# EAGLE board DUE_V02g (EAGLE 9.6.2), part 1 of 2
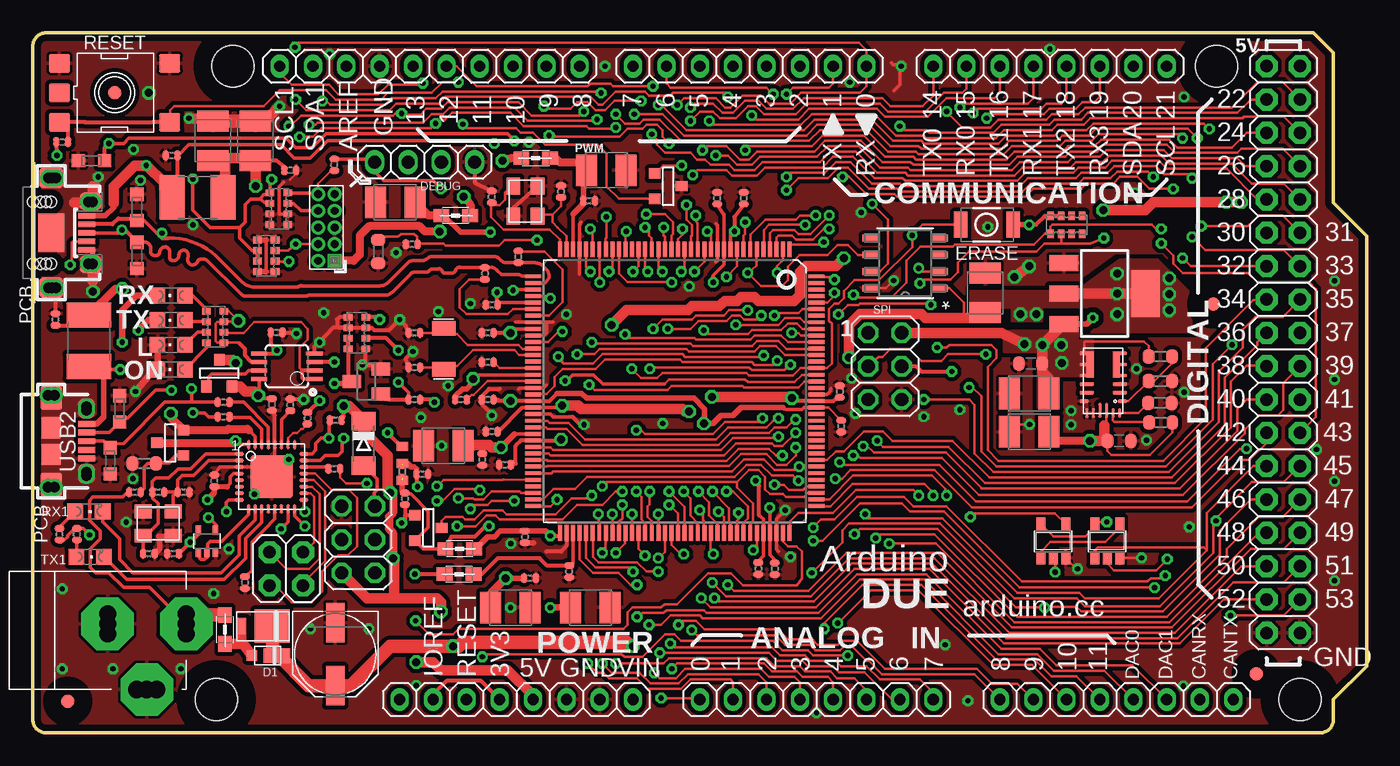
[diagram p2: board, top side]
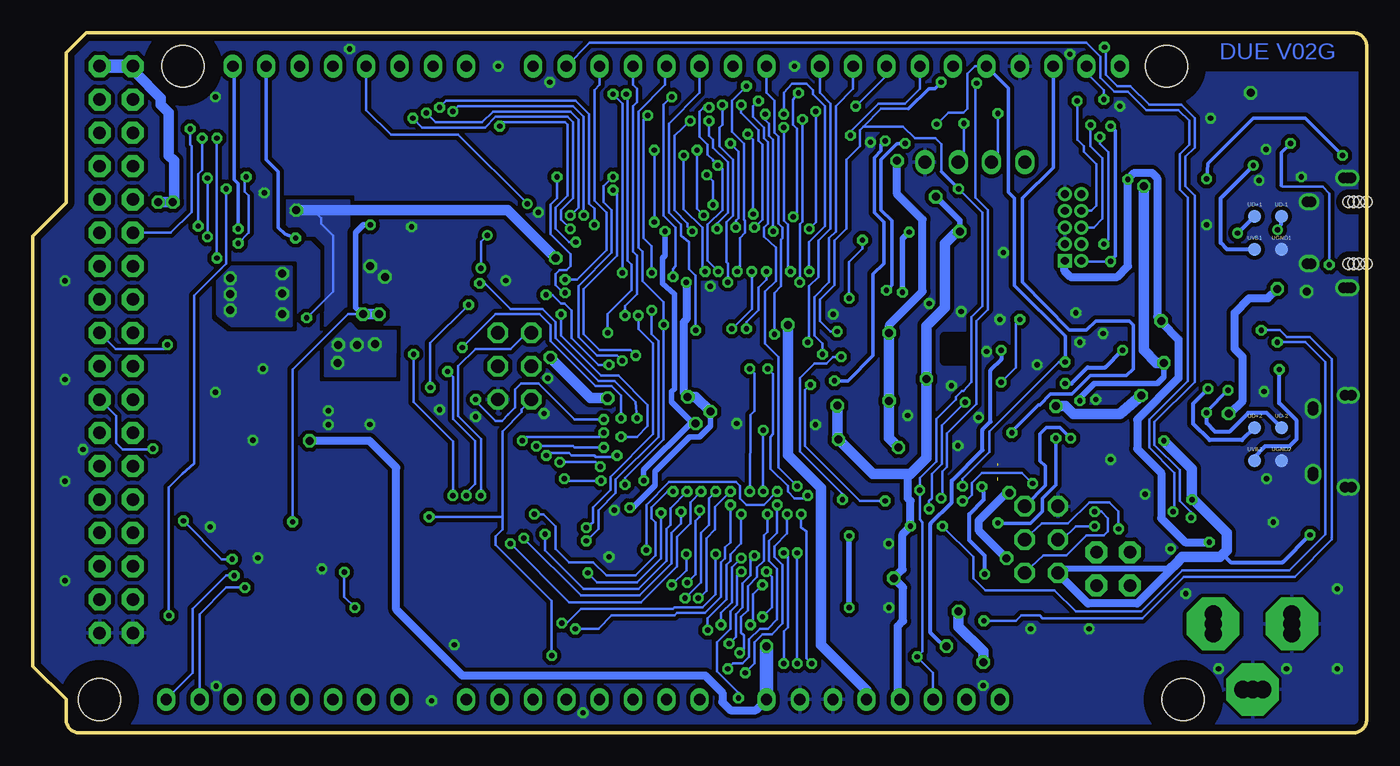
[diagram p3: board, bottom side, seen from below]

Size 101.6 x 53.34 mm. Coordinates in mm from the lower left corner, seen from the top.
Outline: 97.54,53.34 99.06,51.82 99.06,40.39 101.6,37.85 101.6,5.08 99.06,2.54 99.06,1 arc-90 98.06,0 1,0 arc-90 0,1 0,52.34 arc-90 1,53.34 97.54,53.34
Copper layers (1*16): Top 0.035mm / dielectric 1.6mm / Bottom 0.035mm
Design rules "default *": minimum track width 8mil, minimum drill 16mil, track to track 8mil, track to pad 8mil, pad to pad 8mil, via to via 8mil, smd to smd 6mil, copper to edge 20mil, drill to drill 12mil, minimum pad ring 9mil, minimum via ring 8mil, stop-mask expansion 2mil, vias tented up to drill 25mil, thermal gap 8mil
Net classes: 0 default: width 0.203 mm, drill 0.406 mm, clearance 0.203 mm; 1 USB: width 0.203 mm, drill 0.406 mm, clearance 0.203 mm; 2 gnd: width 0.203 mm, drill 0.406 mm, clearance 0.203 mm; 3 usbvcc: width 0.203 mm, drill 0.406 mm, clearance 0.203 mm; 4 USBpair: width 0.254 mm, drill 0.406 mm, clearance 0.61 mm to class 0, clearance 0.61 mm to class 1, clearance 0.61 mm to class 2, clearance 0.61 mm to class 3
Holes 3.2 mm at 96.52,2.54 15.24,50.8 90.17,50.8 13.97,2.54
tRestrict: area 12.7,48.3 to 17.8,53.3; area 87.6,48.3 to 92.7,53.3; area 94,0 to 99.1,5.1; area 11.4,0 to 16.5,5.1
bRestrict: area 12.7,48.3 to 17.8,53.3; area 87.6,48.3 to 92.7,53.3; area 94,0 to 99.1,5.1; area 11.4,0 to 16.5,5.1; 1 lines

## Footprints (pad centres in the part's own frame; a part is rotated, then mirrored left to right if it is on the bottom)
1X08 = drill 0.85 pad 1.422 long: 1 -8.89,0; 2 -6.35,0; 3 -3.81,0; 4 -1.27,0; 5 1.27,0; 6 3.81,0; 7 6.35,0; 8 8.89,0
J0402 = smd 0.7 x 0.9: 1 -0.65,0; 2 0.65,0; 3 1.95,0
SMC_B = smd 1.6 x 2.4: + -1.5,0; - 1.5,0
C0402 = smd 0.508 x 0.762: 1 -0.445,0; 2 0.445,0
C0603-ROUND = smd 0.898 x 1.1: 1 -0.889,0; 2 0.889,0
PINHEAD_2X05_127 = drill 0.6 pad 1.016 square: 1 -0.635,2.54 | drill 0.6 pad 1.016: 2 0.635,2.54; 3 -0.635,1.27; 4 0.635,1.27; 5 -0.635,0; 6 0.635,0; 7 -0.635,-1.27; 8 0.635,-1.27; 9 -0.635,-2.54; 10 0.635,-2.54
MICROSMP = smd 0.8 x 0.8: A 1.2,0 | smd 2 x 1.1: K -0.7,0
MINIMELF = smd 1.4 x 1.8: A 1.7,0; C -1.7,0
DO220AAL = smd 2.667 x 2.54: P$1 -0.7,0 | smd 0.762 x 1.27: P$2 1.65,0
PH1X4-THT = drill 1 pad 1.422 long: 1 0,0; 2 2.54,0; 3 5.08,0; 4 7.62,0
SMD_157SW = smd 1.016 x 1.981: 1 0,0; 2 4,0
L1812 = smd 1.9 x 3.4: 1 -1.95,0; 2 1.95,0
FIDUCIA-MOUNT = smd 1.016 x 1.016: P$1 0,0
MSOP08 = smd 0.3 x 1.2: 1 -0.976,-2.113; 2 -0.326,-2.113; 3 0.324,-2.113; 4 0.974,-2.113; 5 0.974,2.112; 6 0.324,2.112; 7 -0.326,2.112; 8 -0.976,2.112
SOT23-5 = smd 0.69 x 0.99: 1 -0.95,-1.29; 2 0,-1.29; 3 0.95,-1.29; 4 0.95,1.3; 5 -0.95,1.3
SOT223 = smd 1.219 x 2.235: 1 -2.311,-3.099; 2 0,-3.099; 3 2.311,-3.099 | smd 3.6 x 2.2: 4 0,3.099
QFN-20 = smd 0.7 x 0.25: 1 -1.45,1.55; 4 -1.45,-0.4; 5 -1.45,-1.25; 6 -1.45,-2.1; 7 1.45,-2.1; 8 1.45,-1.25; 9 1.45,-0.4; 12 1.45,1.55 | smd 1.1 x 0.25: 2 -1.25,0.9; 3 -1.25,0.25; 10 1.25,0.25; 11 1.25,0.9 | smd 0.25 x 0.7: 13 1.25,2.45; 14 0.75,2.45; 17 -0.75,2.45; 18 -1.25,2.45 | smd 0.25 x 1.1: 15 0.25,2.25; 16 -0.25,2.25 | smd 0.6 x 1.95: 19 -1,-1.25; 20 1,-1.25
MLF32 = smd 0.7 x 0.28: 1 -2.45,1.75; 2 -2.45,1.25; 3 -2.45,0.75; 4 -2.45,0.25; 5 -2.45,-0.25; 6 -2.45,-0.75; 7 -2.45,-1.25; 8 -2.45,-1.75; 17 2.45,-1.75; 18 2.45,-1.25; 19 2.45,-0.75; 20 2.45,-0.25; 21 2.45,0.25; 22 2.45,0.75; 23 2.45,1.25; 24 2.45,1.75 | smd 0.28 x 0.7: 9 -1.75,-2.45; 10 -1.25,-2.45; 11 -0.75,-2.45; 12 -0.25,-2.45; 13 0.25,-2.45; 14 0.75,-2.45; 15 1.25,-2.45; 16 1.75,-2.45; 25 1.75,2.45; 26 1.25,2.45; 27 0.75,2.45; 28 0.25,2.45; 29 -0.25,2.45; 30 -0.75,2.45; 31 -1.25,2.45; 32 -1.75,2.45 | smd 3.254 x 3.254: 33 0,0
SC70-5 = smd 0.4 x 0.7: 1 -0.65,-0.85; 2 0,-0.85; 3 0.65,-0.85; 4 0.65,0.85; 5 -0.65,0.85
2X03 = drill 1.016 pad 1.55 octagon: 1 -2.54,-1.27; 2 -2.54,1.27; 3 0,-1.27; 4 0,1.27; 5 2.54,-1.27; 6 2.54,1.27
2X02 = drill 0.95 pad 1.676 octagon: 1 -1.27,-1.27; 2 -1.27,1.27; 3 1.27,-1.27; 4 1.27,1.27
R0402 = smd 0.508 x 0.762: 1 -0.445,0; 2 0.445,0
CHIPLED_0805 = smd 1.2 x 1.2: A 0,-1.05; C 0,1.05
0805 = smd 1.2 x 1: 1 -1.1,0; 2 1.1,0
PANASONIC_D = smd 3 x 1.4: + 2.4,0; - -2.4,0
1X10 = drill 0.85 pad 1.422 long: 1 -11.43,0; 2 -8.89,0; 3 -6.35,0; 4 -3.81,0; 5 -1.27,0; 6 1.27,0; 7 3.81,0; 8 6.35,0; 9 8.89,0; 10 11.43,0
SOT23 = smd 1 x 1.4: 1 -0.95,-1.1; 2 0.95,-1.1; 3 0,1.1
R0603-ROUND = smd 0.898 x 1.1: 1 -0.889,0; 2 0.889,0
TS42 = smd 1.6 x 1.4: 1 -4.2,2.25; 2 4.2,2.25; 3 -4.2,-2.25; 4 4.2,-2.25; 5 -4.2,0
CAY16 = smd 0.5 x 0.65: 1 -1.2,-0.675; 2 -0.4,-0.675; 3 0.4,-0.675; 4 1.2,-0.675; 5 1.2,0.675; 6 0.4,0.675; 7 -0.4,0.675; 8 -1.2,0.675
SOT-23 = smd 0.787 x 0.889: 1 0.025,-1.016; 2 -0.94,1.016; 3 0.991,1.016
LQFP144 = smd 0.3 x 1.2: 1 -8.75,-10.8; 2 -8.25,-10.8; 3 -7.75,-10.8; 4 -7.25,-10.8; 5 -6.75,-10.8; 6 -6.25,-10.8; 7 -5.75,-10.8; 8 -5.25,-10.8; 9 -4.75,-10.8; 10 -4.25,-10.8; 11 -3.75,-10.8; 12 -3.25,-10.8; 13 -2.75,-10.8; 14 -2.25,-10.8; 15 -1.75,-10.8; 16 -1.25,-10.8; 17 -0.75,-10.8; 18 -0.25,-10.8; 19 0.25,-10.8; 20 0.75,-10.8; 21 1.25,-10.8; 22 1.75,-10.8; 23 2.25,-10.8; 24 2.75,-10.8; 25 3.25,-10.8; 26 3.75,-10.8; 27 4.25,-10.8; 28 4.75,-10.8; 29 5.25,-10.8; 30 5.75,-10.8; 31 6.25,-10.8; 32 6.75,-10.8; 33 7.25,-10.8; 34 7.75,-10.8; 35 8.25,-10.8; 36 8.75,-10.8; 73 8.75,10.8; 74 8.25,10.8; 75 7.75,10.8; 76 7.25,10.8; 77 6.75,10.8; 78 6.25,10.8; 79 5.75,10.8; 80 5.25,10.8; 81 4.75,10.8; 82 4.25,10.8; 83 3.75,10.8; 84 3.25,10.8; 85 2.75,10.8; 86 2.25,10.8; 87 1.75,10.8; 88 1.25,10.8; 89 0.75,10.8; 90 0.25,10.8; 91 -0.25,10.8; 92 -0.75,10.8; 93 -1.25,10.8; 94 -1.75,10.8; 95 -2.25,10.8; 96 -2.75,10.8; 97 -3.25,10.8; 98 -3.75,10.8; 99 -4.25,10.8; 100 -4.75,10.8; 101 -5.25,10.8; 102 -5.75,10.8; 103 -6.25,10.8; 104 -6.75,10.8; 105 -7.25,10.8; 106 -7.75,10.8; 107 -8.25,10.8; 108 -8.75,10.8 | smd 1.2 x 0.3: 37 10.8,-8.75; 38 10.8,-8.25; 39 10.8,-7.75; 40 10.8,-7.25; 41 10.8,-6.75; 42 10.8,-6.25; 43 10.8,-5.75; 44 10.8,-5.25; 45 10.8,-4.75; 46 10.8,-4.25; 47 10.8,-3.75; 48 10.8,-3.25; 49 10.8,-2.75; 50 10.8,-2.25; 51 10.8,-1.75; 52 10.8,-1.25; 53 10.8,-0.75; 54 10.8,-0.25; 55 10.8,0.25; 56 10.8,0.75; 57 10.8,1.25; 58 10.8,1.75; 59 10.8,2.25; 60 10.8,2.75; 61 10.8,3.25; 62 10.8,3.75; 63 10.8,4.25; 64 10.8,4.75; 65 10.8,5.25; 66 10.8,5.75; 67 10.8,6.25; 68 10.8,6.75; 69 10.8,7.25; 70 10.8,7.75; 71 10.8,8.25; 72 10.8,8.75; 109 -10.8,8.75; 110 -10.8,8.25; 111 -10.8,7.75; 112 -10.8,7.25; 113 -10.8,6.75; 114 -10.8,6.25; 115 -10.8,5.75; 116 -10.8,5.25; 117 -10.8,4.75; 118 -10.8,4.25; 119 -10.8,3.75; 120 -10.8,3.25; 121 -10.8,2.75; 122 -10.8,2.25; 123 -10.8,1.75; 124 -10.8,1.25; 125 -10.8,0.75; 126 -10.8,0.25; 127 -10.8,-0.25; 128 -10.8,-0.75; 129 -10.8,-1.25; 130 -10.8,-1.75; 131 -10.8,-2.25; 132 -10.8,-2.75; 133 -10.8,-3.25; 134 -10.8,-3.75; 135 -10.8,-4.25; 136 -10.8,-4.75; 137 -10.8,-5.25; 138 -10.8,-5.75; 139 -10.8,-6.25; 140 -10.8,-6.75; 141 -10.8,-7.25; 142 -10.8,-7.75; 143 -10.8,-8.25; 144 -10.8,-8.75
SOIC8_SA_SST_MCH-L = smd 1.255 x 0.508: 1 -2.621,1.905; 2 -2.621,0.635; 3 -2.621,-0.635; 4 -2.621,-1.905; 5 2.621,-1.905; 6 2.621,-0.635; 7 2.621,0.635; 8 2.621,1.905
TP-1.00MM = smd 1 x 1 bottom: X 0,0
MCR-AB1-S-RA-SMT = smd 0.4 x 1.35: 1 -1.3,2.7; 2 -0.65,2.7; 3 0,2.7; 4 0.65,2.7; 5 1.3,2.7 | drill 0.8: P$1 -4.175,0.356; P$3 -4.175,0.076; P$4 -4.175,-0.203; P$5 4.175,0.356; P$6 4.175,0.076; P$7 4.175,-0.203 | smd 2.9 x 2: P$2 0,0 | drill 0.8 pad 1.27: P$8 -2.35,3.15; P$9 -2.35,2.85; P$10 2.35,3.15; P$11 2.35,2.85 | smd 1.3 x 1.6: S1 -2.4,3; S2 2.4,3 | smd 1.5 x 1.8: S3 -4.175,0; S4 4.175,0 | hole 0.85: -2.375,0; 2.375,0; -2.375,-1.4; 2.375,-1.4; -2.375,-0.4; 2.375,-0.4; 2.375,-0.8; -2.375,-0.8
CON2_USB_MICRO_B_AT = smd 0.406 x 1.346: P1 -1.321,2.692; P2 -0.66,2.692; P3 0,2.692; P4 0.66,2.692; P5 1.321,2.692 | drill 0.8 pad 1.24: P$1 -2.616,2.692; P$2 -2.362,2.692; P$7 2.362,2.692; P$8 2.616,2.692 | drill 0.8 pad 1.25: P$3 -3.505,-0.254; P$4 -3.505,0.254; P$5 3.505,0.254; P$6 3.505,-0.254 | smd 1.778 x 1.651: S1 -3.302,0; S2 3.302,0 | smd 1.524 x 1.27: S3 -2.489,2.692; S4 2.489,2.692 | smd 1.626 x 1.524: S5 -1.016,0; S6 1.016,0
POWERSUPPLY_DC-21MM = drill 1.3 pad 4 octagon: 1 -5.08,-3.353; 2 -0.076,-6.35; 3 -0.076,-0.356 | drill 1.3: 4 -5.08,-4.115; 5 -5.08,-2.591; 6 -0.838,-0.356; 7 0.686,-0.356; 8 -0.838,-6.35; 9 0.686,-6.35
2X18 = drill 0.95 pad 1.676 octagon: 1 -21.59,-1.27; 2 -21.59,1.27; 3 -19.05,-1.27; 4 -19.05,1.27; 5 -16.51,-1.27; 6 -16.51,1.27; 7 -13.97,-1.27; 8 -13.97,1.27; 9 -11.43,-1.27; 10 -11.43,1.27; 11 -8.89,-1.27; 12 -8.89,1.27; 13 -6.35,-1.27; 14 -6.35,1.27; 15 -3.81,-1.27; 16 -3.81,1.27; 17 -1.27,-1.27; 18 -1.27,1.27; 19 1.27,-1.27; 20 1.27,1.27; 21 3.81,-1.27; 22 3.81,1.27; 23 6.35,-1.27; 24 6.35,1.27; 25 8.89,-1.27; 26 8.89,1.27; 27 11.43,-1.27; 28 11.43,1.27; 29 13.97,-1.27; 30 13.97,1.27; 31 16.51,-1.27; 32 16.51,1.27; 33 19.05,-1.27; 34 19.05,1.27; 35 21.59,-1.27; 36 21.59,1.27
CRYSTAL-3.2-2.5 = smd 1.3 x 1.05: 1 -1.15,-0.925; 2 1.15,-0.925; 3 1.15,0.925; 4 -1.15,0.925
RESONATOR_EPSON_FC_145 = smd 1.1 x 1.8: P$1 -1.55,0; P$2 1.55,0
CT/CN0603 = smd 1 x 1: 1 -1,0; 2 1,0

## Placement (x,y rotation side)
ADCH  FH254-108DF08500V  [1X08]  82.55,2.54 0 top
ADCL  FH254-108DF08500V  [1X08]  59.69,2.54 0 top
BR1  NM  [J0402]  28.14,21.18 270 top
C1  22uF  [SMC_B]  36.37,9.55 0 top
C2  22uF  [SMC_B]  27.61,40.44 180 top
C3  22uF  [SMC_B]  42.47,9.55 0 top
C4  100nF  [C0402]  35.97,20.42 0 top
C5  100nF  [C0402]  52.12,40.74 270 top
C6  100nF  [C0402]  34.95,22.96 0 top
C7  100nF  [C0402]  56.52,12.5 90 top
C8  100nF  [C0402]  61.47,26.01 270 top
C9  100nF  [C0402]  34.95,32.61 0 top
C10  100nF  [C0402]  37.49,14.94 90 top
C11  22uF  [SMC_B]  31.27,21.87 180 top
C12  100nF  [C0402]  34.24,20.83 90 top
C13  100nF  [C0402]  54.15,40.74 270 top
C14  100nF  [C0402]  34.65,30.48 0 top
C15  100nF  [C0402]  34.65,25.4 0 top
C16  100nF  [C0402]  55.27,12.52 90 top
C17  100nF  [C0402]  61.57,23.37 90 top
C18  100nF  [C0402]  37.87,11.79 180 top
C19  100nF  [C0402]  40.84,12.29 90 top
C20  10n  [C0402]  2.24,45.01 180 top
C21  22pF  [C0402]  40.23,41.25 90 top
C22  22pF  [C0402]  34.95,40.84 90 top
C23  22pF  [C0402]  29.06,27.84 180 top
C24  22pF  [C0402]  29.06,30.48 180 top
C25  22pF  [C0402]  28.85,37.24 180 top
C26  10n  [C0402]  10.57,43.99 180 top
C27  22uF  [SMC_B]  16.97,45.11 90 top
C28  100nF  [C0402]  1.73,31.5 90 top
C29  22uF  [SMC_B]  72.54,33.53 90 top
C30  100nF  [C0402]  18.21,25.02 90 top
C31  100nF  [C0402]  18.57,30.51 180 top
C32  100nF  [C0402]  42.37,40.54 180 top
C33  22uF  [SMC_B]  43.69,42.88 0 top
C34  100nF  [C0402]  29.67,19.71 180 top
C35  22uF  [SMC_B]  13.72,45.11 90 top
C36  100nF  [C0402]  13.82,19.2 90 top
C37  100nF  [C0402]  10.69,13.65 180 top
C38  1uF  [C0402]  19.61,24.99 90 top
C39  22pF  [C0402]  8.84,13.65 0 top
C40  22pF  [C0402]  11.48,18.34 0 top
C41  100nF  [C0603-ROUND]  82.75,22.26 0 top
C49  22uF  [SMC_B]  75.9,22.94 180 top
C50  100nF  [C0603-ROUND]  76,28.14 180 top
CN2  PINHEAD-2x5-P1.27  [PINHEAD_2X05_127]  22.35,38.51 180 top
COMMUNICATION  FH254-108DF08500V  [1X08]  77.47,50.8 0 top
D1  MSS1P3L-M3/89A  [MICROSMP]  17.88,5.89 180 top
D2  CD1206-S01575  [MINIMELF]  25.2,22.05 270 top
D5  SS1P3L  [DO220AAL]  17.53,8.13 180 top
DEBUG  [PH1X4-THT]  33.66,43.48 180 top
ERASE  157SW  [SMD_157SW]  74.68,38.71 180 top
F1  MF-MSMF050-2 500mA  [L1812]  12.55,40.79 180 top
F2  MF-MSMF050-2 500mA  [L1812]  4.27,29.87 270 top
FID1  FIDUCIALMOUNT  [FIDUCIA-MOUNT]  89.92,32.68 0 top
FID2  FIDUCIALMOUNT  [FIDUCIA-MOUNT]  93.19,4.5 0 top
FID3  FIDUCIALMOUNT  [FIDUCIA-MOUNT]  6.22,48.77 0 top
FID4  FIDUCIALMOUNT  [FIDUCIA-MOUNT]  2.67,2.41 0 top
IC1  LMV358IDGKR  [MSOP08]  19.35,27.94 90 top
IC2  74AHC1G86DBV  [SOT23-5]  77.72,14.61 0 top
IC3  74AHC1G86DBV  [SOT23-5]  81.84,14.61 0 top
IC4  NX1117CE33Z  [SOT223]  81.64,33.48 270 top
IC5  MPM3610  [QFN-20]  81.53,26.82 180 top
IC6  ATMEGA16U2-MU  [MLF32]  18.19,19.51 0 top
IC10  74LVC1G125DCKR  [SC70-5]  13.26,14.6 0 top
ICSP1  ICSP  [2X03]  24.79,14.73 90 top
JP5  2x2M - NM  [2X02]  19.31,12.5 180 top
JR1  0R  [R0402]  28.14,19.91 90 top
L  Yellow  [CHIPLED_0805]  10.54,29.57 90 top
L1  MH2029-300Y  [0805]  32.51,14.02 0 top
L2  MH2029-300Y  [0805]  32.21,39.42 180 top
L3  MH2029-300Y  [0805]  32.46,12.09 0 top
L5  MH2029-300Y  [0805]  38.3,43.79 0 top
L6  MH2029-300Y  [0805]  14.63,7.87 90 top
ON  Green  [CHIPLED_0805]  10.54,27.69 90 top
PC1  47uF  [PANASONIC_D]  23.04,5.99 270 top
PC2  22uF  [SMC_B]  75.9,25.86 180 top
POWER  FH254-108DF08500V  [1X08]  36.83,2.54 0 top
PWMH  FH254-110DF08500V  [1X10]  30.23,50.8 180 top
PWML  FH254-108DF08500V  [1X08]  54.61,50.8 180 top
Q2  BC847B  [SOT23]  25.4,26.77 90 top
R1  0R  [R0402]  22.96,43.28 90 top
R2  10K  [R0402]  19.61,42.88 180 top
R3  1K  [R0402]  29.06,25.4 180 top
R4  100k  [R0402]  32.61,25.4 180 top
R5  39R 1%  [R0402]  36.98,36.27 90 top
R6  39R 1%  [R0402]  34.44,35 270 top
R7  6K8  [R0603-ROUND]  26.31,36.68 90 top
R8  0R  [R0402]  34.65,28.24 0 top
R9  1M  [R0402]  9.55,18.34 0 top
R13  10K  [R0402]  23.06,23.83 0 top
R14  1K  [R0402]  3.35,15.14 270 top
R15  1K  [R0402]  2.03,15.14 90 top
R16  100k  [R0402]  7.77,18.34 180 top
R17  75K  [R0603-ROUND]  8.48,20.52 0 top
R18  10K  [R0402]  16.16,11.46 270 top
R19  22R  [R0402]  14.53,24.08 180 top
R20  22R  [R0402]  14.53,25.2 180 top
R21  1K  [R0402]  20.93,23.98 90 top
R23  1K  [R0402]  22.96,20.12 0 top
R28  100K_1%  [R0603-ROUND]  85.88,28.68 180 top
R29  19K1_0,1%  [R0603-ROUND]  85.88,26.8 180 top
R30  100k  [R0603-ROUND]  85.9,23.65 180 top
R31  56k  [R0603-ROUND]  85.85,25.15 180 top
R99  10K  [R0402]  28.35,17.83 90 top
RESET  TS42  [TS42]  6.22,48.77 0 top
RN1  100k  [CAY16]  18.75,39.93 90 top
RN2  100k  [CAY16]  17.78,36.35 270 top
RN3  1K  [CAY16]  13.89,30.94 270 top
RN4  100k  [CAY16]  24.69,30.48 270 top
RN5  1K5  [CAY16]  78.74,38.71 180 top
RX  Yellow  [CHIPLED_0805]  10.54,33.32 90 top
RX1  Yellow  [CHIPLED_0805]  4.27,16.87 270 top
SPI  ICSP  [2X03]  64.9,27.94 270 top
T1  PMV48XP  [SOT-23]  14.22,27.41 180 top
T2  PMV48XP  [SOT-23]  10.46,22.12 270 top
T3  PMV48XP  [SOT-23]  30.12,15.6 90 top
T4  PMV48XP  [SOT-23]  48.39,41.63 90 top
TX  Yellow  [CHIPLED_0805]  10.54,31.45 90 top
TX1  Yellow  [CHIPLED_0805]  4.37,13.41 270 top
U1  ATSAM3X8EA-AU  [LQFP144]  48.9,26.04 180 top
U2  ATTINY102F-SSNRSOIC8_SA_SST_MCH-L  [SOIC8_SA_SST_MCH-L]  66.45,35.79 180 top
U$1  DNP  [FRAME]  0,0 0 top
U$2  DNP  [FRAME]  0,0 0 top
UD+1  DNP  [TP-1.00MM]  8.53,39.37 0 top
UD+2  DNP  [TP-1.00MM]  8.53,23.27 0 top
UD-1  DNP  [TP-1.00MM]  6.5,39.37 0 top
UD-2  DNP  [TP-1.00MM]  6.5,23.27 0 top
UGND1  DNP  [TP-1.00MM]  6.5,36.83 0 top
UGND2  DNP  [TP-1.00MM]  6.5,20.73 0 top
USB1  MCR-AB1-S-RA-SMT-TR  [MCR-AB1-S-RA-SMT]  1.4,38.1 270 top
USB2  MCR-B-S-RA-SMT-CS1TR  [CON2_USB_MICRO_B_AT]  1.4,22.23 270 top
UVB1  DNP  [TP-1.00MM]  8.53,36.83 0 top
UVB2  DNP  [TP-1.00MM]  8.53,20.73 0 top
X2  POWER-SUPPLY  [POWERSUPPLY_DC-21MM]  5.33,8.38 90 top
XIO  18x2F-H8.5  [2X18]  95.25,29.21 270 top
Y1  12mHz-12pF-K7  [CRYSTAL-3.2-2.5]  37.52,40.51 270 top
Y2  32,768Khz_SMD  [RESONATOR_EPSON_FC_145]  31.29,29.26 90 top
Y4  16Mhz-KX-7  [CRYSTAL-3.2-2.5]  9.55,15.95 0 top
Z1  BRNCG0603MLC-05E  [CT/CN0603]  7.92,36.37 270 top
Z2  BRNCG0603MLC-05E  [CT/CN0603]  7.92,40.03 90 top
Z3  BRNCG0603MLC-05E  [CT/CN0603]  6.6,24.69 270 top
Z4  BRNCG0603MLC-05E  [CT/CN0603]  5.89,20.73 90 top
Z5  BRNCG0603MLC-05E  [CT/CN0603]  4.47,43.59 0 top

## Tracks (layer width: path | path; a pad name or v marks a point on that pad's centre or on a via)
8PB4
  Top 0.203: IC6.18 21.16,18.26 21.44,17.98 21.44,14.53 JP5.1
8PB5
  Top 0.203: IC6.19 21.27,18.76 21.84,18.19 21.84,13.31 21.03,12.5 19.31,12.5 JP5.3
8PB6
  Top 0.203: IC6.20 21.38,19.26 22.25,18.39 22.25,13.11 20.58,11.43 JP5.2
8PB7
  Top 0.203: IC6.21 21.49,19.76 22.76,18.49 24.08,18.49 24.69,17.88 24.69,14.22 23.98,13.51 23.27,13.51 22.05,12.29 22.05,10.77 21.23,9.96 19.71,9.96 18.44,11.23 JP5.4
16U2-TX
  Top 0.254: IC6.9 16.44,16.64 14.4,14.6 13.5,14.6 13.3,14.4 13.3,13.79 IC10.2 13.26,13.37 13.11,13.21 12.8,13.21 12.61,13.4 IC10.1
+3V3  (via drill 0.41, 0.61)  (1 unrouted)
  Top 0.203: C1.+ 34.95,9.55 | 38,24.79 U1.57 38.19,24.78 | 52.64,36.88 U1.11 | L2.1 33.36,39.45 33.33,39.62 | 17.09,36.73 RN2.2 | 61.57,25.4 C8.2 | 15.75,29.67 15.72,29.74 RN3.5 14.05,29.74 13.92,29.87 13.92,31.19 14.02,31.29 14.52,31.29 RN3.7 15.59,31.34 v15.65,31.39 14.9,32.14 RN3.8 | U2.1 69.83,33.88 70.92,32.79 70.92,31.65 70.87,31.6 | IC2.5 77.72,14.96 80.16,14.96 80.89,15.69 IC3.5 81.06,16.08 v81.81,16.08
  Top 0.254: 17.09,36.73 17.07,36.73 17.07,36.12 17.04,35.95 RN2.3 | C37.1 11.13,13.67 | RN2.2 16.69,36.75 15.75,37.69 15.75,38.51 | 15.75,38.51 13.51,38.51 12.19,39.83 v12.19,42.22 | 17.32,40.68 16.61,40.68 16.15,40.23 16.15,38.91 15.75,38.51 | 17.32,40.68 17.37,40.79 17.58,41 17.94,41 RN1.5 18.07,41.95 v18.19,42.16 | RN1.6 17.78,40.33 17.32,40.68 | 28.38,18.19 28.8,18.19 30.12,16.87 30.12,15.67 T3.2 29.74,14.02 L1.1
  Top 0.279: 37.27,24.78 38,24.79 | U1.52 34.02,27.29 33.71,27.08 | v40.32,24.93 40.13,24.79 40.12,24.78 38.19,24.78 | v51.82,34.34 51.82,34.85 52.64,35.67 52.64,36.8 52.65,36.8 U1.11 | 52.64,36.88 52.64,39.5 | v56.13,17.17 56.15,17.23 U1.105 56.15,13.55 56.52,13.18 C7.2
  Top 0.305: 52.64,39.5 C5.2 | v57.81,25.5 58.03,25.29 U1.125 60.97,25.29 61.25,25.57 C8.2 | C4.2 36.78,20.52 36.78,21.89 37.17,22.29 U1.62 40.17,22.29 v40.23,22.35 | C20.2 v1.83,43.99 | 11.13,13.67 v11.99,14.53 12.61,15.15 IC10.5 | IC1.6 16.64,28.26 16.15,28.75 16.15,29.26 15.75,29.67 | POWER.4 34.14,3.96 31.5,3.96 30.48,2.95 POWER.2 | C6.2 35.46,22.96 37.27,24.78 | 28.38,18.19 R99.2 28.14,18.43 | v34.75,15.75 34.44,15.75 33.63,14.94 31.87,14.94 L1.1 | RN5.3 RN5.4 77.08,39.38 76.4,38.71 v75.89,38.71
  Top 0.406: 33.71,27.08 v33.53,26.98 33.53,26.72 33.02,26.21 32.72,26.21 32.17,25.67 R4.2 | ERASE.1 v75.89,38.71 | IC4.4 84.28,34.24 | v36.02,11.79 C18.2 | JR1.1 28.14,18.43
  Top 0.61: v32.82,40.84 33.33,40.23 33.33,39.62 | v30.99,38.2 29.87,38.2 29.46,38.61 25.6,38.61 24.89,37.9 24.89,36.42 24.43,35.97 CN2.1 | 34.95,9.55 34.95,10.72 v36.02,11.79
  Top 0.813: IC4.2 IC4.4 | v62.18,28.6 62.18,31.09 62.99,31.9 67.67,31.9 67.97,31.6 70.87,31.6 72.21,31.6 C29.+ 72.67,31.9 | v51.71,25.6 57.71,25.6 v57.81,25.5 | v40.32,24.93 41.52,24.93 41.76,24.69 49.48,24.69 49.68,24.49 v49.99,24.49
  Bottom 0.203: v81.81,16.08 81.81,27.69 77.6,31.9 v76.45,31.9
  Bottom 0.254: v12.19,42.22 12.09,43.38 8.64,46.84 4.67,46.84 v1.83,43.99
  Bottom 0.406: v75.89,38.71 76.4,38.71 77.01,38.1 77.01,32.41 v76.45,31.9 | 18.19,42.06 v18.19,42.16 | 50.09,24.38 v49.99,24.49 49.99,23.37 50.8,22.55 51.56,22.55 54.2,19.91 54.2,18.85 55.88,17.17 v56.13,17.17 | v40.23,22.35 40.32,22.47 | v32.82,40.84 30.99,39.01 v30.99,38.2 | v15.65,31.39 15.65,31.29
  Bottom 0.61: 18.19,42.06 18.19,35.56 19,34.75 22.55,34.75 23.01,35.2 23.01,35.94 CN2.1 | v18.19,42.16 17.68,42.67 16.36,42.67 15.95,42.27 15.95,31.7 v15.65,31.39 | v51.82,34.34 51.82,31.5 52.02,31.29 52.02,25.91 v51.71,25.6 | 15.65,31.29 14.33,29.97 14.33,27.03 17.48,23.88 17.48,21.64 15.65,19.81 15.65,16.36 13.82,14.53 v11.99,14.53 | 34.75,19.71 34.95,19.51 34.95,17.88 34.75,17.68 v34.75,15.75 35.36,15.14 35.36,12.45 v36.02,11.79 35.31,11.07 35.31,8.53 35.71,8.13 35.71,2.69 POWER.4
  Bottom 0.813: v75.23,31.9 v76.45,31.9 | v51.71,25.6 51.1,25.6 v49.99,24.49 | 40.32,22.47 v40.32,24.93 | v40.23,22.35 37.59,19.71 34.75,19.71 33.53,20.93 v33.53,26.98 33.53,30.99 32.11,32.41 32.11,37.29 31.19,38.2 v30.99,38.2 | v57.81,25.5 59.13,25.5 62.18,28.55 v62.18,28.6
  other vias: 82.6,35 82.6,33.48 86.56,34.65 86.56,33.43 82.6,31.9 86.56,32.21
  pour Top (isolate 0.406, no thermals): 71.42,32.41 71.42,33.68 79.5,33.68 82.8,36.07 85.7,36.07 88.19,33.53 88.24,30.53 80.31,30.53 80.31,32.46 76.86,32.46 76.86,31.39 74.57,31.39 74.57,32.41
  pour Bottom: 81.94,35.51 86.46,35.51 87.53,34.44 87.53,31.9 87.43,31.8 86.46,31.04 81.94,31.04
+5V  (via drill 0.41, 0.61)
  Top 0.203: R28.2 84.99,29.46 84.63,29.82 80.16,29.82 80.11,29.77 80.11,28.95 IC5.7
  Top 0.254: IC6.4 15.29,19.76 15.04,19.51 15.04,19 14.79,18.76 | IC6.32 15.74,21.96 v15.44,22.25 | v4.32,15.09 3.82,15.58 R14.1 3.19,15.58 2.64,15.04 2.64,14.94 2.4,14.69 R15.1 | IC1.8 17.24,25.78 v17.17,25.7
  Top 0.305: C30.2 17.41,25.46 v17.17,25.7 | R13.2 23.67,24.14 v23.67,24.89
  Top 0.406: 25.3,23.98 25.27,23.98 D2.C | 14.79,18.76 C36.1 13.83,18.3 v13.31,17.78 | 15.34,22.15 v15.44,22.25 | v80.74,31.62 80.29,31.17 IC4.3
  Top 0.61: 27.03,18.49 27.43,18.09 27.43,16.76 27.13,16.46 27.13,15.54 27.43,15.24 v27.43,13.31 | T2.1 15.29,22.1 v15.44,22.25
  Top 0.813: v29.21,5.38 30.48,5.38 31.09,4.78 36.17,4.78 38.1,2.85 POWER.5 | v81.53,39.83 84.73,39.83 85.34,40.44 v90.93,40.44 v92.05,40.44 | v44.09,31.09 45.21,32.21 49.89,32.21 50.19,32.51 52.27,32.51 52.73,32.92 53.65,32.92 53.95,33.22 54.97,33.22 55.27,32.92 57.96,32.92 58.42,33.38 58.42,35.1 58.88,35.56 61.16,35.56 v61.77,36.17 | 23.71,24.95 v23.67,24.89 24.08,24.89 24.99,23.98 25.27,23.98 | T1.2 15.77,26.39 16.15,26.01 16.87,26.01 v17.17,25.7 | v31.09,9.25 31.09,9.96 30.79,10.26 27.53,10.26 | ICSP1.2 25.45,10.26 27.53,10.26 | 27.03,18.49 27.03,21.13 25.2,22.96 D2.C | 27.53,10.26 27.53,12.9 27.43,13.11 v27.43,13.31 | SPI.2 73.76,30.48 v75.54,29.62 | PC2.+ 77.37,25.88 77.37,27.03 76.89,27.51 C50.1 76.91,28.17 v76.91,29.57 78.51,31.17 IC4.3
  Bottom 0.203: 80.16,39.83 80.16,39.73 79.65,39.22 79.65,38.81 78.74,37.9 78.74,33.62 v80.74,31.62
  Bottom 0.305: v4.32,15.09 6.4,13.01 10.36,13.01 10.97,13.61
  Bottom 0.406: 13.21,17.78 v13.31,17.78
  Bottom 0.457: 14.94,12.5 23.21,12.5
  Bottom 0.61: 11.18,13.41 10.97,13.61 | 23.57,12.19 21.23,9.86 17.48,9.86 14.58,12.75 14.58,12.85 | v27.23,18.29 27.43,18.29 29.57,16.15 29.57,15.44 v27.43,13.31 | 23.21,12.5 ICSP1.2
  Bottom 0.813: XIO.1 93.78,50.29 91.85,48.36 91.85,47.85 91.24,47.24 91.24,43.99 90.83,43.59 90.83,40.64 91.03,40.44 | v44.09,31.09 44.09,21.18 41.55,18.64 41.55,6.71 38.1,3.25 POWER.5 | v61.77,36.17 65.43,39.83 80.16,39.83 v81.53,39.83 | v90.93,40.44 91.03,40.44 | 91.03,40.44 v92.05,40.44 | v13.31,17.78 13.31,20.12 v15.44,22.25 | v23.67,24.89 22.96,24.89 22.35,24.28 18.8,24.28 v17.17,25.7 | v29.21,5.38 29.21,6.2 31.09,8.08 v31.09,9.25 | 14.94,12.5 14.58,12.85 14.02,13.41 11.18,13.41 | 10.97,13.61 10.67,13.92 10.67,15.23 13.21,17.78
  Bottom 1.016: XIO.1 XIO.2
  other vias: 78.33,29.57 78.38,28.19
  pour Bottom (isolate 0.406): 73.96,30.63 74.02,27.18 79.35,27.18 79.3,37.08 80.11,37.9 81.58,37.9 82.3,38.61 82.3,40.54 77.52,40.54 77.52,31.34 76.81,30.63
  pour Top (no thermals): 76.61,24.79 78.03,24.79 78.03,27.23 80.72,27.23 80.72,29.87 79.55,29.87 79.55,31.65 77.62,31.65 77.62,30.58 74.02,30.58 74.02,29.06 76.61,29.06
AD0  (via drill 0.41)
  Top 0.203: v47.65,12.29 46.74,12.29 46.02,13.01 43.08,13.01 42.67,13.41 42.67,15.04 U1.78 | ADCL.1 50.8,2.64 v47.85,2.64
  Bottom 0.203: v47.65,12.29 47.95,11.99 47.95,9.75 48.46,9.25 48.46,7.92 49.48,6.91 49.48,4.67 47.85,3.05 v47.85,2.64
AD1  (via drill 0.41)
  Top 0.203: U1.79 43.18,15.23 43.18,16.05 43.08,16.15 v43.08,16.66 | v42.27,5.28 42.98,4.57 43.48,4.57 43.89,4.17 46.02,4.17 46.84,3.35 49.38,3.35 50.09,4.06 53.14,4.06 53.34,3.86 ADCL.2
  Bottom 0.203: v43.08,16.66 43.08,15.65 42.67,15.34 42.67,5.69 v42.27,5.28
AD2  (via drill 0.41)
  Top 0.203: v43.38,13.72 43.64,13.92 U1.80 | ADCL.3 55.88,3.86 55.27,4.47 49.89,4.47 49.17,3.76 47.04,3.76 46.23,4.57 44.09,4.57 v43.38,5.28
  Bottom 0.203: v43.38,5.28 v43.38,13.72
AD3  (via drill 0.41)
  Top 0.203: U1.81 44.15,16.61 v44.15,16.66 | ADCL.4 58.42,3.86 58.01,4.27 56.08,4.27 55.47,4.88 49.68,4.88 48.97,4.17 47.75,4.17 v47.35,4.57
  Bottom 0.203: v44.15,16.66 44.15,15.19 45.11,14.22 45.11,13.41 44.5,12.8 44.5,8.33 45.31,7.52 46.02,7.52 46.63,6.91 46.63,5.28 v47.35,4.57
AD4  (via drill 0.41)
  Top 0.203: U1.82 44.65,16.09 44.91,16.36 v44.91,17.37 | 60.96,2.44 ADCL.5 60.96,3.86 60.55,4.27 58.62,4.27 58.22,4.67 56.29,4.67 55.68,5.28 49.07,5.28 v48.67,4.88
  Bottom 0.203: v44.91,17.37 44.91,15.24 45.52,14.63 45.52,13.11 44.91,12.5 44.91,8.64 45.62,7.92 46.23,7.92 47.04,7.11 47.04,5.79 47.55,5.28 48.26,5.28 v48.67,4.88
AD5  (via drill 0.41)
  Top 0.203: v44.4,13.72 45.11,14.43 45.11,15.04 U1.83 | v44.4,5.28 48.06,5.28 48.46,5.69 55.88,5.69 56.49,5.08 58.42,5.08 58.83,4.67 60.76,4.67 61.27,4.17 62.59,4.17 63.5,3.25 ADCL.6
  Bottom 0.203: v44.4,13.72 44.09,13.41 44.09,8.03 44.4,7.72 v44.4,5.28
AD6  (via drill 0.41)
  Top 0.203: U1.84 45.65,16.59 v45.64,16.66 | v47.75,6.1 56.08,6.1 56.69,5.49 58.62,5.49 59.03,5.08 60.96,5.08 61.42,4.62 63.35,4.62 65.43,2.54 ADCL.7
  Bottom 0.203: v47.75,6.1 47.45,6.4 47.45,7.42 47.65,7.62 47.65,8.84 47.14,9.35 47.14,11.18 46.43,11.89 46.43,12.6 45.92,13.11 45.92,15.04 45.64,15.32 v45.64,16.66
AD7  (via drill 0.41)
  Top 0.203: v46.63,13.51 46.58,13.56 46.13,14.02 46.13,15.04 U1.85 | ADCL.8 68.58,3.05 67.56,4.06 64.52,4.06 63.5,5.08 61.57,5.08 61.16,5.49 59.23,5.49 58.83,5.89 56.9,5.89 56.29,6.5 48.87,6.5 v48.56,6.81
  Bottom 0.203: v46.63,13.51 46.94,13.21 46.94,11.99 47.55,11.38 47.55,9.55 48.06,9.04 48.06,7.32 v48.56,6.81
AD8  (via drill 0.41)
  Top 0.203: U1.88 47.65,16.55 v47.65,16.66 | v50.19,7.82 50.57,7.44 56.57,7.44 57.3,6.71 59.2,6.71 59.6,6.3 61.48,6.3 61.78,6.6 62.38,6.6 63.5,5.49 63.67,5.49 64.68,4.47 71.73,4.47 ADCH.1
  Bottom 0.203: v47.65,16.66 47.65,14.43 48.46,13.61 48.46,13.11 48.77,12.8 48.77,10.16 50.19,8.74 v50.19,7.82
AD9  (via drill 0.41)
  Top 0.203: v49.17,8.23 49.48,8.53 50.49,8.53 51.16,7.87 56.74,7.87 57.51,7.11 59.37,7.11 59.77,6.71 61.31,6.71 61.62,7.01 62.79,7.01 64.92,4.88 71.91,4.88 73.05,3.73 75.01,3.73 ADCH.2 | U1.89 48.16,15.04 48.16,13.85 48.14,13.8 47.73,13.39 | 47.63,13.31 47.73,13.39 | 47.73,13.39 v47.65,13.31
  Bottom 0.203: v49.17,8.23 49.17,9.14 48.36,9.96 48.36,12.6 v47.65,13.31
AD10  (via drill 0.41)
  Top 0.203: v49.58,13.61 49.38,13.61 48.67,14.33 48.67,15.24 U1.90 | v61.32,8.36 63.83,10.87 67.46,10.87 73.15,5.18 76.1,5.18 ADCH.3
  Bottom 0.203: v49.58,13.61 49.58,10.57 50.6,9.55 52.73,9.55 52.83,9.45 59.84,9.45 60.94,8.36 v61.32,8.36
AD11(TXD3)  (via drill 0.41)
  Top 0.203: v60.27,7.92 60.27,8.36 63.18,11.28 67.67,11.28 73.36,5.59 76.3,5.59 77.57,4.32 79.5,4.32 ADCH.4 | U1.91 49.12,15.29 49.12,16.71 v48.46,17.37
  Bottom 0.203: v48.46,17.37 48.46,14.53 48.87,14.12 48.87,13.31 49.17,13.01 49.17,10.36 50.39,9.14 52.53,9.14 52.73,8.94 57.51,8.94 58.52,7.92 v60.27,7.92
AD14(RXD3)  (via drill 0.41)
  Top 0.203: U1.92 49.65,17.21 v48.46,18.39 | v50.9,10.26 51.61,9.55 59.64,9.55 62.59,12.5 68.28,12.5 73.97,6.81 87.38,6.81 90.73,10.16 XIO.33
  Bottom 0.203: v48.46,18.39 49.63,17.22 49.63,15.49 50.29,14.83 50.29,10.82 v50.9,10.26
AREF  (via drill 0.41)
  Top 0.305: BR1.1 27.94,21.95 v27.03,22.86
  Bottom 0.254: PWMH.8 23.88,43.08 26.21,40.74 26.21,34.34 22.66,30.68 21.34,30.68 20.62,31.39 18.09,31.39 17.78,31.09 17.78,27.74 18.29,27.23 21.03,27.23 22.45,25.81 24.08,25.81 24.89,24.99 24.99,24.99 26.82,23.16 v27.03,22.86
AVREF
  Top 0.203: 41.15,12.9 41.05,12.8 C19.2
  Top 0.279: U1.75 41.15,12.9
  Top 0.305: C19.2 39.18,12.74 38.61,13.31 35.41,13.31 34.19,12.09 L3.2
AVREFL  (via drill 0.41)  (1 unrouted)
  Top 0.305: L3.1 v29.11,12.09 28.96,12.09 | C34.2 29.22,18.55 v29.31,18.75
  Top 0.406: BR1.2 28.53,20.53 28.8,20.26 29.06,20.26 29.22,20.1 C34.2
  Bottom 0.305: v29.31,18.75 29.16,18.29 29.16,17.78 30.28,16.66 30.28,14.68 29.11,13.51 v29.11,12.09
BD+  (via drill 0.41)
  Top 0.254: 11.99,25.2 10.06,25.2 6.91,22.05 5.99,22.03 Z4.2 5.89,21.74 5.38,22.25 4.12,22.25 USB2.P3 | 11.99,25.2 R20.2 | v12.09,26.21 12.09,25.3 11.99,25.2
  Bottom 0.305: v12.09,26.21 13.21,25.09 13.21,23.55 11.96,22.3 9.49,22.3 UD+2.X
BD-  (via drill 0.41)
  Top 0.254: R19.2 13.41,24.08 13.11,24.38 v12.19,24.38 | v10.57,26.11 9.35,26.11 7.21,23.98 6.53,23.98 6.52,23.99 Z3.2 5.8,22.89 USB2.P2
  Bottom 0.254: v10.57,26.11 12.19,24.49 v12.19,24.38
  Bottom 0.305: UD-2.X 7.62,24.38 9.02,24.38 10.46,22.94 11.53,22.94 12.19,23.6 v12.19,24.38
CANRX0  (via drill 0.41)
  Top 0.203: v45.72,35.15 46.13,35.56 46.13,36.78 U1.24 | v85.45,11.07 85.42,11.1 75.16,11.1 69.39,16.87 66.8,16.87 66.19,17.48 62.99,17.48 60.15,14.63 v59.44,14.63 | v47.24,30.79 47.95,31.5 50.19,31.5 50.49,31.8 52.63,31.8 53.03,32.21 v54.46,32.21
  Bottom 0.203: v85.45,11.07 86.87,11.07 88.9,9.04 ADCH.7 | v54.46,32.21 54.46,30.38 53.95,29.87 53.95,22.55 57.2,19.3 57.2,18.29 58.52,16.97 58.52,15.54 v59.44,14.63 | v47.24,30.79 47.24,31.29 46.33,32.21 46.33,33.93 45.72,34.54 v45.72,35.15
CANTX0  (via drill 0.41)
  Top 0.203: U1.23 46.63,36.84 46.63,35.36 v46.84,35.15 | v48.36,30.79 50.09,30.79 50.7,31.39 52.83,31.39 53.24,31.8 53.85,31.8 54.15,31.5 55.17,31.5 v55.47,31.8 | v59.44,15.65 60.05,16.26 61.06,16.26 62.79,17.98 66.34,17.98 67.06,17.27 69.6,17.27 75.34,11.53 84.9,11.53 85.15,11.79 86.06,11.79 v86.26,11.99 86.11,11.84
  Bottom 0.203: v46.84,35.15 46.84,32.31 v48.36,30.79 | v55.47,31.8 55.47,30.79 54.36,29.67 54.36,22.76 57.61,19.51 57.61,18.49 58.93,17.17 58.93,16.05 v59.44,15.65 | v86.26,11.99 86.87,11.99 89.41,9.45 89.41,4.57 ADCH.8
CANTX1/IO  (via drill 0.41)
  Top 0.203: U1.140 60.52,32.78 61.06,33.33 v61.06,33.53 | v61.67,42.37 62.18,42.37 63.5,41.05 65.63,41.05 65.84,40.84 75.59,40.84 76.2,41.45 79.86,41.45 80.26,41.86 82.3,41.86 82.8,42.37 84.12,42.37 85.04,41.45 v86.87,41.45 | v91.24,8.94 95.3,8.94 XIO.34
  Bottom 0.203: v91.24,8.94 91.24,18.69 90.22,19.71 89.31,20.52 89.31,33.33 86.87,35.76 v86.87,41.45 | v61.67,42.37 61.67,40.74 62.18,40.23 62.18,38 60.66,36.47 60.66,35.56 60.96,35.26 61.47,35.26 61.77,34.95 61.77,34.14 61.16,33.53 v61.06,33.53
CMP  (via drill 0.41)
  Top 0.203: 17.07,28.91 IC1.5 | 24.18,26.62 Q2.3
  Top 0.305: 17.07,28.91 18.34,28.91 v18.59,29.16 18.12,29.63 C31.2 | 24.74,26.62 24.03,26.62 RN4.4 RN4.3
  Top 0.406: v22.96,26.62 24.03,26.62 24.18,26.62
  Bottom 0.305: v22.96,26.62 22.48,26.62 21.26,27.84 19.91,27.84 v18.59,29.16
D+  (via drill 0.41)
  Top 0.254: 37.3,34.8 37.95,34.8 U1.37 | 37.3,34.8 arc-45 37.28,34.81 | 7.92,37.39 8.53,37.39 arc-90 8.99,36.87 arc90 9.19,36.37 9.2,36.37 arc90 9.65,36.58 arc-90 10.11,37.03 arc-90 10.41,36.58 10.41,36.32 arc90 10.67,35.97 arc90 11.12,36.42 arc-90 11.53,36.78 arc-90 11.84,36.27 arc90 12.04,35.66 arc90 12.6,36.02 arc-67 13.27,36 15.81,33.46 arc45 16.22,33.27 20.46,33.27 arc45 20.44,33.28 20.87,33.28 arc-45 21.07,33.35 26.89,33.35 arc45 27.44,33.64 28.77,34.97 arc-45 29.07,35.1 29.95,35.1 arc45 30.13,35.16 arc-45 30.46,35.36 30.89,35.36 arc-90 31.19,35.15 arc90 31.39,35.05 31.8,35.05 arc90 32.21,35.26 arc-90 32.61,35.46 34.63,35.46 | 37.3,34.8 arc-45 37.28,34.81 | 36.2,34.93 37.03,34.92 37.28,34.81 | 36.2,34.93 36,34.92 arc22 35.88,34.94 36.11,34.92 arc-10 36.2,34.93 | 36.2,34.93 35.96,34.93 arc-45 35.61,34.98 35.44,35.14 arc45 34.93,35.47 34.63,35.46 | 34.39,35.46 R6.1 34.63,35.46 | 37.28,34.81 37.29,34.8
  Top 0.305: 4.37,38.1 USB1.3 4.12,38.12 4.17,38.08 6.81,38.1 v6.78,38.33 7.06,38.28 7.85,37.49 7.56,37.37 Z1.1 | 7.92,37.39 Z1.1 | 7.84,37.37 Z1.1
  Bottom 0.305: v6.78,38.33 6.5,38.73 UD-1.X
D-  (via drill 0.41)
  Top 0.254: 7.92,39.19 8.48,39.01 9.8,37.69 10.3,37.69 arc-45 13.96,36.33 15.78,34.51 arc45 16.73,33.98 20.05,33.98 arc45 20.3,34.03 arc-45 20.51,34.06 26.37,34.06 arc45 27.02,34.28 28.55,35.81 arc-45 28.99,35.98 29.6,35.98 arc38 29.99,36.11 30.09,36.19 arc-38 30.48,36.3 35.11,36.3 arc-54 35.6,36.06 arc54 36.15,35.83 36.94,35.83 | 7.72,39.01 Z2.1 | U1.38 38.88,34.28 arc45 39.06,34.33 39.28,34.6 arc45 39.32,34.77 39.32,34.87 arc45 39.07,35.35 38.84,35.59 arc45 38.25,35.81 36.98,35.81 R5.1 | USB1.2 4.45,38.75 arc45 4.47,38.76 | R5.1 36.94,35.83 | 36.94,35.83 36.98,35.76 R5.1
  Top 0.305: 4.22,38.76 4.47,38.76 6.04,38.76 6.5,39.19 7.92,39.19 Z2.1 7.91,39.01 | v9.83,38.08 9.88,37.68 10.3,37.69
  Bottom 0.305: UD+1.X 8.69,39.22 v9.83,38.08
DAC0(CANRX1)  (via drill 0.41)
  Top 0.203: v46.02,11.28 45.52,11.28 44.6,12.19 42.67,12.19 41.66,13.21 41.66,15.04 U1.76 | v46.94,8.23 47.85,8.23 48.56,8.94 50.8,8.94 51,8.74 60.05,8.74 62.99,11.68 67.87,11.68 73.56,5.99 76.5,5.99 77.78,4.72 81.64,4.72 ADCH.5 83.72,2.64
  Bottom 0.203: v46.02,11.28 46.74,10.57 46.74,8.64 v46.94,8.23
DAC1  (via drill 0.41)
  Top 0.203: U1.77 42.15,13.33 42.88,12.6 45.41,12.6 v45.72,12.29 | v46.02,8.84 46.13,8.84 46.43,9.14 48.06,9.14 48.26,9.35 51.1,9.35 51.31,9.14 59.84,9.14 62.79,12.09 68.07,12.09 73.76,6.4 76.71,6.4 77.98,5.13 83.77,5.13 ADCH.6
  Bottom 0.203: v45.72,12.29 45.31,11.89 45.31,9.55 v46.02,8.84
DTR
  Top 0.254: IC6.13 18.44,16.29 17.6,15.45 16.7,14.55 16.7,12.4 16.3,12 R18.1
ERASE_CMD  (via drill 0.41)
  Top 0.254: IC6.23 21.88,20.76 22.25,21.13 23.27,21.13 23.57,21.44 23.57,22.35 v23.67,22.45
  Top 0.305: R99.1 28.35,16.56 | 28.35,16.56 28.35,16.26 v28.09,16 | T3.3 28.37,16.59 28.35,16.56
  Bottom 0.254: v23.67,22.45 23.67,18.9 24.69,17.88 24.69,16.87 25.6,15.95 28.04,15.95 v28.09,16
ERASE_S  (via drill 0.41)
  Top 0.203: v42.57,18.09 42.37,17.88 41.05,17.88 39.83,16.66 36.07,16.66 35.76,16.97 34.34,16.97 33.63,16.26 32.92,16.26 32.72,16.46 31.45,16.46 31.14,16.15 T3.1 | v45.62,27.74 46.33,27.03 47.55,27.03 47.95,27.43 54.36,27.43 54.56,27.23 57.91,27.23 58.47,27.79 U1.130 60.5,27.79 60.86,28.14 60.86,31.19 60.66,31.39 60.66,32.31 61.06,32.72 61.37,32.72 61.77,33.12 61.77,33.68 62.59,34.49 64.47,34.49 66.98,37.01 v66.98,37.9 66.98,37.92 67.77,38.71 ERASE.2 | U2.2 67.77,35.15 67.49,35.43 v67.46,35.41
  Bottom 0.203: v42.57,18.09 42.67,18.09 42.88,17.88 43.59,17.88 44.09,18.39 44.09,18.8 45.41,20.12 45.41,22.55 45.21,22.76 45.21,27.33 v45.62,27.74 | v67.46,35.41 67.46,37.41 v66.98,37.9
GATE_CMD
  Top 0.203: 17.07,27.61 IC1.7
  Top 0.254: 17.07,27.61 16.43,27.61 16.15,27.33 13.61,27.33 13.41,27.13 13.41,26.42 T1.3
GND  (via drill 0.41, 0.61)
  Top 0.203: 41.66,36.98 U1.33 | 10.36,51.61 RESET.2 | U1.126 59.74,25.79 59.74,25.78 | 57.1,16.97 v57.3,16.97 | R2.1 20.05,42.61 19.61,42.16 | U2.8 65,33.88 v65.58,34.47 | IC2.3 79.49,12.5 v79.58,12.5 | IC3.3 84.44,13.31 v84.45,13.34 | C49.- 74.95,23.5 v75.92,23.5
  Top 0.254: IC6.28 18.44,19.51 | C36.2 14.22,20.26 IC6.3 17.54,20.26 17.68,20.12 17.68,20.02 IC6.33 | 56.65,14.58 56.65,13.97 56.79,13.82 | v57.3,16.97 56.64,16.31 56.64,14.58 56.65,14.58 | 56.65,15.19 56.65,14.58 | 65.39,51.04 65.53,50.9 65.94,50.9 66.04,50.8 66.04,49.38 65.6,48.93 | 4.57,35.76 4.57,35.78 USB1.S2 | U1.46 38.92,30.29 39.12,30.48 39.12,31.29 | RN1.2 18.75,39.53 18.75,39.52 18.75,41.6 19.1,41.96 | 17.78,37.54 17.78,35.15
  Top 0.279: 39.12,26.52 38.88,26.29 U1.54 37.05,26.29 36.98,26.21 | U1.33 41.65,38.2 41.64,38.71 | 41.76,38.91 41.64,38.71 | 41.64,38.71 41.64,34.95 | 39.62,31.29 39.12,31.29 U1.44 36.79,31.29 36.78,31.29 | 52.02,38.81 52.15,38.69 U1.12 52.15,35.99 52.02,35.87 | U1.74 40.65,15.13 | 60.8,26.25 60.76,26.21 60.76,26.04 60.5,25.78 59.74,25.78 59.54,25.78 | U1.106 56.65,15.19 | U1.58 39.42,24.29 39.62,24.08 41.1,24.08
  Top 0.305: C31.1 20.09,30.5 v20.07,30.43 | IC1.4 21.47,29.49 v21.84,29.77 22.85,30.88 RN4.2 | RN4.1 23.35,31.68 23.16,31.5 23.16,30.99 23.27,30.89 RN4.2 | RN4.2 RN4.7 25.81,30.88 26.01,30.68 27.13,30.68 v27.94,31.5 28.41,31.03 C24.2 | RN4.5 25.32,29.28 25.3,29.26 25.3,28.25 v25.09,28.04 26.28,28.04 Q2.2 | C23.2 28.41,28.51 v28.96,29.06 | Y1.2 36.54,39.94 Y1.4 | C22.2 33.69,41.9 33.68,42.16 33.68,43.64 | IC6.28 18.44,24.2 C30.1 | C38.2 20.36,25.44 v20.62,25.4 | 40.65,15.13 40.65,14.23 40.23,13.82 39.12,13.82 | C28.2 1.73,33.77 | v34.95,24.18 34.95,24.28 34.2,25.03 34.2,25.36 34.24,25.4 | C15.1 34.2,25.67 34.75,26.21 35.56,26.21 | 41.1,24.08 41.6,23.57 v41.99,23.47
  Top 0.406: Z4.1 6.1,19.41 | C10.1 38.14,14.49 | RN2.5 18.49,35.15 | 4.37,35.87 arc90 4.55,36.07 4.55,36.78 | 4.47,40.95 4.88,40.95 4.88,42.47 | RN2.1 17.77,37.55 17.78,37.54 | 17.78,35.15 RN2.4 | 10.66,14.99 9.65,14.99 | 9.6,14.99 9.65,14.99 | 9.65,14.99 9.65,14.02 C39.2
  Top 0.508: C1.- 38.2,9.88 | L.C ON.C 8.98,27.37 v7.82,26.01
  Top 0.61: 4.57,41.66 4.47,41.66 4.47,40.95 | Y4.2 10.66,14.99
  Top 0.813: C27.- 17.68,46.63 v18.8,47.75 | 73.05,34.75 C29.- 72.82,35.33 72.95,35.26 | v74.78,34.75 v75.89,35.56 | 13.64,46.81 11.91,46.81 v11.89,46.84 | 4.57,41.66 4.57,40.41 3.15,40.41 | 4.57,34.44 4.57,35.76 4.57,35.87 | 4.27,35.79 arc90 4.37,35.87
  Top 1.016: C27.- C35.- 13.64,46.81 | USB1.S2 arc90 4.57,35.77 | USB1.S1 arc-90 4.57,40.43 4.57,40.41 | 4.57,40.41 4.57,40.34 4.67,40.34 arc-90 4.57,40.41
  other vias: 63.09,39.65 49.99,34.04 62.38,27.03 36.38,9.55 2.24,4.88 2.24,10.97 13.77,10.62 4.57,33.63 7.67,44.45 99.16,11.61 99.16,19.18 99.16,26.92 99.16,34.44 4.98,42.37 33.32,32.72 36.41,14.42 71.22,2.44 83.97,41.15 6.1,4.88 30.89,32.11 8.84,48.77 11.28,4.88 7.62,19.35 7.11,16.05 21.13,7.92 25.6,7.92 27.67,36.59 8.2,42.11 29.57,24.03 19.51,20.83 31.13,21.87 31.63,26.44 62.66,24.33 66.14,50.8 62.23,49.58 14.94,14.02 12.19,38.71 47.98,23.57 22.61,51.71 87.68,48.46 16.87,18.19 22.15,32 59.69,1.52 29.21,3.61 43.59,50.8 88.09,15.7 40.64,31.9 72.75,38.56 77.47,52.12 87.68,25.96 97.79,21.59 87.63,3.56 69.49,6.71 37.8,45.01 57.71,13.41 70.61,24.61 67.87,24.08 84.84,22.3 84.07,27.74 79.1,24.54 79.1,23.47
  pour Top (isolate 0.305, rank 2): 102.11,53.85 102.11,-0.51 -1.02,-0.51 -1.02,52.83 arc-89 0,53.85
  pour Bottom (isolate 0.305, rank 2): -0.51,54.86 103.12,54.86 103.12,-1.52 -1.52,-1.52 -1.52,53.34 arc-90
JTAG_RESET
  Top 0.203: R1.1 22.72,42.84 21.72,41.83 CN2.10
  Top 0.254: RN1.4 21.64,41.13 CN2.10
JTAG_TCK  (via drill 0.41)
  Top 0.203: RN2.7 18.59,36.73 19.46,36.73 v20.02,37.24 CN2.4 | U1.28 44.15,35.41 v43.89,35.15 | v44.4,46.13 44.3,46.02 42.37,46.02 42.16,46.23 37.39,46.23 36.37,47.24 31.93,47.24 31.42,46.74 30.99,46.74 v30.68,46.43 | 30.96,46.71 v30.68,46.43 | v30.68,46.43 30.33,46.08 22,46.08 21.34,45.41 v20.32,45.41
  Bottom 0.203: v43.89,35.15 44.09,35.36 44.09,38.71 44.4,39.01 v44.4,46.13 | v20.32,45.41 20.32,44.91 19.66,44.25 19.66,37.59 v20.02,37.24 | v30.68,46.43 30.68,43.92 DEBUG.2
JTAG_TDI  (via drill 0.41)
  Top 0.203: v22.05,48.16 22.35,48.16 22.66,47.85 26.82,47.85 27.33,48.36 30.68,48.36 31.19,48.87 43.18,48.87 v43.28,48.77 | U1.29 43.64,37.67 43.69,37.72 v43.69,39.32 | CN2.8 21.72,39.8 21.74,39.83
  Top 0.254: RN1.3 19.87,40.33 20.42,39.78 CN2.8
  Bottom 0.203: v43.69,39.32 43.38,39.62 43.38,46.02 43.69,46.33 43.69,48.26 v43.28,48.77 | v22.05,48.16 22.05,45.21 21.54,44.7 21.54,44.3 20.57,43.33 20.57,40.18 20.98,39.78 CN2.8
JTAG_TDO  (via drill 0.41)
  Top 0.203: v42.98,46.74 42.88,46.63 37.69,46.63 36.68,47.65 31.76,47.65 31.25,47.14 30.38,47.14 29.72,46.48 21.69,46.48 21.54,46.33 v21.03,46.33 | U1.30 43.13,36.8 43.13,36.58 43.18,36.58 v43.18,34.34
  Bottom 0.203: v21.03,46.33 21.03,44.7 20.12,43.79 20.12,39.17 20.78,38.51 CN2.6 | v42.98,46.74 42.98,38.96 43.18,38.76 v43.18,34.34
JTAG_TMS  (via drill 0.41)
  Top 0.203: v19.51,35.92 18.59,35.92 RN2.6 | v42.47,38.41 42.65,38.23 42.65,37.01 U1.31 | v41.96,47.35 41.66,47.04 38,47.04 36.98,48.06 31.59,48.06 31.08,47.55 29.97,47.55 29.54,47.12 28.52,47.12 28.45,47.19 v28.09,47.19 27.58,47.19 27.43,47.04 20.42,47.04 19.61,46.23 v19.51,46.23
  Bottom 0.203: v41.96,47.35 41.96,38.91 v42.47,38.41 | v19.51,35.92 21.49,35.92 | v28.09,47.19 28.09,43.97 DEBUG.3
  Bottom 0.254: v19.51,35.92 19.51,35.97 19.15,36.32 19.15,45.87 v19.51,46.23
  Bottom 0.305: 21.49,35.92 21.67,35.92 CN2.2
L13
  Top 0.203: 21.34,26.98 IC1.1 | RN3.6 14.79,30.54 14.94,30.48 16.05,30.48 16.87,31.29 20.42,31.29 20.93,30.79 20.93,29.97 20.32,29.36 20.32,27.8 20.5,27.61
  Top 0.254: 21.34,26.98 20.57,26.98 20.52,27.03 20.52,27.59 20.5,27.61
  Top 0.305: IC1.2 20.5,27.61
MASTER-RESET  (via drill 0.41)
  Top 0.203: 9.14,46.53 RESET.4 10.46,46.56 10.46,47.45 10.77,47.75 17.58,47.75 18.8,48.97 22.35,48.97 23.06,48.26 26.52,48.26 27.03,48.77 30.38,48.77 31.19,49.58 v32.41,49.58 | U1.47 39.23,29.79 40.03,30.58 v40.34,30.58 | v62.08,5.89 59.44,5.89 59.03,6.3 57.1,6.3 56.39,7.01 49.38,7.01 48.87,7.52 48.16,7.52 46.43,5.79 45.06,5.79 44.86,5.99 34.44,5.99 v34.24,5.79 | v25.45,19 23.88,19 23.41,19.47 R23.2 | v34.04,18.49 33.63,18.49 33.53,18.59 32.11,18.59 31.19,17.68 v30.79,17.68 | v71.42,16.46 71.69,16.74 77.84,16.74 IC2.4
  Top 0.254: v31.09,41.45 30.48,42.06 26.72,42.06 26.04,42.75 DEBUG.4 25.79,43.73 R1.2
  Top 0.305: 2.54,46.52 3.96,46.52 3.96,46.53 9.14,46.53 10.06,46.53 | 2.54,46.52 RESET.3 | RESET.4 10.42,46.63 10.06,46.63 10.06,46.53 | 10.06,46.53 10.46,46.53 | C20.1 2.68,46.38 2.54,46.52
  Bottom 0.203: 38.33,46.2 38.61,45.92 38.61,44.7 39.62,43.69 39.62,38.41 40.54,37.49 40.54,34.14 41.66,33.02 41.66,31.39 40.84,30.58 v40.34,30.58 | 38.33,46.2 36.98,47.55 34.9,47.55 | SPI.5 63.6,25.4 64.36,24.64 64.36,24.43 65.84,22.96 65.84,16.41 | POWER.3 33.02,4.57 v34.24,5.79 33.83,6.2 33.83,16.05 34.04,16.26 v34.04,18.49 34.04,19.41 32.77,20.68 32.77,23.93 31.29,25.4 31.29,25.6 30.84,26.06 30.73,26.06 30.12,26.72 30.12,31.7 29.26,32.51 29.26,39.62 v31.09,41.45 | v25.45,19 26.26,19.81 29.31,19.81 30.07,19.05 30.07,18.14 30.53,17.68 v30.79,17.68 | v62.08,5.89 62.08,10.06 66.34,14.33 66.34,14.99 65.84,15.49 65.84,16.41 | 32.38,42.75 32.38,44.86 32.84,45.31 34.42,45.31 35.31,46.2 38.33,46.2 | v71.42,16.46 65.89,16.46 65.84,16.41
  Bottom 0.254: v31.09,41.45 32.38,42.75 | 34.9,47.55 33.35,49.1 32.89,49.1 v32.41,49.58
MISO  (via drill 0.41)
  Top 0.203: U1.108 57.71,16.15 58.32,16.76 60.96,16.76 62.69,18.49 67.06,18.49 v67.46,18.09
  Bottom 0.203: 63.6,30.48 SPI.1 64.01,30.48 65.23,29.26 67.87,29.26 69.19,27.94 69.19,24.13 67.46,22.4 v67.46,18.09
MISO2  (via drill 0.41)
  Top 0.203: IC6.17 20.64,16.96 v20.73,16.87
  Bottom 0.203: v20.73,16.87 20.22,16.87 19.71,16.36 19.71,15.34 20.02,15.04 21.34,15.04 22.86,13.51 24.64,13.51 ICSP1.1
MOSI  (via drill 0.41)
  Top 0.203: U1.109 59.74,17.27 60.76,17.27 62.43,18.95 67.92,18.95 68.58,18.29 v68.58,18.09 | 66.14,27.94 SPI.4 66.17,27.96 66.14,27.94
  Top 0.305: 66.14,27.94 67.26,27.94 67.67,27.53 v70,27.53
  Bottom 0.203: v70,27.53 69.6,27.13 69.6,23.93 67.92,22.25 67.92,18.95 68.58,18.29 v68.58,18.09
MOSI2  (via drill 0.41)
  Top 0.254: IC6.16 19.94,16.54 v20.73,15.75
  Bottom 0.203: v20.73,15.75 22.15,15.75 23.16,14.73 ICSP1.4
N$1
  Top 0.203: IC6.26 19.44,22.48 19.81,22.86 20.12,22.86 20.42,23.16 20.56,23.16 R21.1
N$2
  Top 0.254: L.A 12.56,30.54 RN3.3
N$3
  Top 0.254: RN3.4 13.22,29.31 ON.A
N$4
  Top 0.254: 3.21,16.91 3.25,16.87 RX1.A 2.03,15.68 R15.2
N$5
  Top 0.203: U1.51 35.55,27.79 R8.2
N$6  (via drill 0.41)
  Top 0.203: 25.4,31.7 RN4.8
  Top 0.254: R3.2 28.61,25.95 v27.84,26.72
  Top 0.279: 27.13,25.4 26.82,25.4 26.42,25.81 26.42,25.8 Q2.1
  Top 0.305: v26.42,31.5 26.21,31.7 25.4,31.7 | 27.13,25.4 R3.2 28.65,25.4
  Bottom 0.203: v27.84,26.72 26.72,27.84 26.72,31.19 v26.42,31.5
N$7
  Top 0.203: U1.53 38,26.82 34.65,26.82 33.58,25.76 33.41,25.76 R4.1
N$10
  Top 0.813: L6.1 16,6.77 | 16,6.77 D1.A | D5.P$2 15.88,7 16,6.77
N$11
  Top 0.203: U1.43 39.3,31.79 40.34,32.82 40.34,35.31 38.96,36.68 36.74,36.68 | 36.73,36.68 36.74,36.68 | 36.74,36.68 36.73,36.68 | 36.73,36.68 36.74,36.68 | 36.74,36.68 R5.2 | 36.73,36.68 36.74,36.68 | 36.74,36.68 36.73,36.68 | 36.73,36.68 36.74,36.68 | 36.74,36.68 36.73,36.68 | 36.73,36.68 36.74,36.68
N$12
  Top 0.203: U1.42 38,32.31 36.58,32.31 36.17,31.9 33.02,31.9 32.51,32.41 32.51,33.83 33.24,34.56 R6.2
N$13
  Top 0.203: IC2.1 76.77,13.81 77.52,14.55 81.69,14.55 82.79,15.66 IC3.4
N$14
  Top 0.254: R14.2 3.35,13.45 TX1.A
N$15
  Top 0.254: R17.2 8.74,20.52 8.48,20.27 8.48,18.61 R16.1
  Top 0.305: T2.3 10.92,21.13 10.36,20.57 9.42,20.57 R17.2
N$35
  Top 0.203: IC5.1 83.46,25.27 R29.2 85.42,26.8 86.77,28.14 R28.1
N$36
  Top 0.203: IC5.17 82.28,23.79 82.4,23.67 84.99,23.67 R30.2
N$37
  Top 0.203: IC5.18 84.19,24.37 R31.2
N$54
  Top 0.254: RN3.1 13.22,32.3 12.19,33.33 RX.A
N$55
  Top 0.254: RN3.2 11.89,31.34 arc90 TX.A
PIN22  (via drill 0.41)
  Top 0.203: v60.25,37.39 60.05,37.19 57.61,37.19 U1.1 | v66.04,46.23 66.34,45.92 68.07,45.92 68.28,45.72 73.15,45.72 73.76,46.33 77.42,46.33 77.83,46.74 79.86,46.74 80.37,47.24 91.75,47.24 92.76,48.26 XIO.3
  Bottom 0.203: v60.25,37.39 60.76,37.39 61.77,38.41 61.77,40.03 60.86,40.95 60.86,46.33 61.06,46.53 65.73,46.53 v66.04,46.23
PIN23  (via drill 0.41)
  Top 0.203: v59.64,39.42 58.42,39.42 58.12,39.12 55.8,39.12 54.66,37.97 54.66,36.98 U1.7 | v69.6,47.35 70.81,46.13 72.95,46.13 73.56,46.74 77.22,46.74 77.62,47.14 79.65,47.14 80.16,47.65 91.34,47.65 93.27,49.58 95.2,49.58 XIO.4
  Bottom 0.203: v59.64,39.42 59.64,46.94 60.45,47.75 69.19,47.75 v69.6,47.35
PIN24  (via drill 0.41)
  Top 0.203: XIO.5 92.46,45.72 91.34,44.6 87.17,44.6 86.56,45.21 81.38,45.21 80.87,44.7 78.84,44.7 78.44,44.3 74.78,44.3 74.17,43.69 67.26,43.69 67.06,43.89 64.92,43.89 63.3,45.52 60.15,45.52 59.33,44.7 54.56,44.7 v54.25,44.4 | U1.8 54.15,37.89 54.25,38 v54.25,38.91
  Bottom 0.203: v54.25,44.4 v54.25,38.91
PIN25  (via drill 0.41)
  Top 0.203: v51.36,38.2 51.64,37.92 51.64,36.96 U1.13 | v51.51,46.63 51.82,46.33 58.52,46.33 59.33,47.14 64.11,47.14 65.73,45.52 67.87,45.52 68.07,45.31 73.36,45.31 73.97,45.92 77.62,45.92 78.03,46.33 80.06,46.33 80.57,46.84 92.15,46.84 92.25,46.94 95.3,46.94 XIO.6
  Bottom 0.203: v51.51,46.63 52.73,45.52 52.73,39.83 51.71,38.81 51.71,38.56 v51.36,38.2
PIN26  (via drill 0.41)
  Top 0.203: v52.02,43.99 52.93,43.99 53.65,43.28 54.76,43.28 55.37,43.89 59.74,43.89 60.55,44.7 62.89,44.7 64.52,43.08 66.65,43.08 66.85,42.88 74.57,42.88 75.18,43.48 78.84,43.48 79.25,43.89 81.28,43.89 81.79,44.4 86.16,44.4 86.77,43.79 91.75,43.79 92.35,43.18 XIO.7 | U1.14 51.15,35.91 v50.39,35.15
  Bottom 0.203: v52.02,43.99 52.02,39.9 50.6,38.48 50.6,35.36 v50.39,35.15
PIN27  (via drill 0.41)
  Top 0.203: XIO.8 95.2,44.5 92.05,44.5 91.75,44.2 86.97,44.2 86.36,44.81 81.58,44.81 81.08,44.3 79.05,44.3 78.64,43.89 74.98,43.89 74.37,43.28 67.06,43.28 66.85,43.48 64.72,43.48 63.09,45.11 60.35,45.11 59.54,44.3 55.17,44.3 54.56,43.69 53.85,43.69 52.83,44.7 51.31,44.7 v51,44.4 | v50.49,39.42 50.49,38.99 50.65,38.84 U1.15 50.65,36.83
  Bottom 0.203: v51,44.4 51,39.93 v50.49,39.42
PIN28  (via drill 0.41)
  Top 0.203: U1.16 50.14,36.78 50.14,37.85 50.19,37.9 50.19,38.6 50.2,38.7 49.78,39.12 v49.78,40.23 | v50.27,42.52 50.62,42.88 52.83,42.88 53.24,42.47 55.17,42.47 55.78,43.08 60.15,43.08 60.96,43.89 62.48,43.89 64.11,42.27 66.24,42.27 66.45,42.06 74.98,42.06 75.59,42.67 79.25,42.67 79.65,43.08 81.69,43.08 82.19,43.59 85.75,43.59 86.36,42.98 90.93,42.98 93.27,40.64 XIO.9
  Bottom 0.203: v49.78,40.23 49.78,42.04 v50.27,42.52
PIN29  (via drill 0.41)
  Top 0.203: XIO.10 95.3,41.86 92.86,41.86 91.34,43.38 86.56,43.38 85.95,43.99 81.99,43.99 81.48,43.48 79.45,43.48 79.05,43.08 75.39,43.08 74.78,42.47 66.65,42.47 66.45,42.67 64.31,42.67 62.69,44.3 60.76,44.3 59.94,43.48 55.58,43.48 54.97,42.88 53.44,42.88 53.03,43.28 51.61,43.28 51.21,43.69 50.6,43.69 50.09,44.2 48.16,44.2 47.55,44.81 47.55,45.21 v47.14,45.62 | U1.19 48.65,37.88 48.77,38 48.77,38.91 48.16,39.52 v46.74,39.52
  Bottom 0.203: v46.74,39.52 46.74,45.21 v47.14,45.62
PIN30  (via drill 0.41)
  Top 0.203: 47.14,36.78 U1.22 47.15,36.78 47.14,36.78 | 47.14,36.78 47.14,37.69 46.94,37.9 46.94,38.2 v46.63,38.51 | v47.65,47.85 47.85,47.85 49.78,45.92 58.73,45.92 59.54,46.74 63.91,46.74 65.53,45.11 67.67,45.11 67.87,44.91 73.56,44.91 74.17,45.52 77.83,45.52 78.23,45.92 80.26,45.92 80.77,46.43 89.2,46.43 v89.61,46.02
  Bottom 0.203: XIO.11 91.08,38.1 89.51,39.67 89.51,44.7 89.61,44.81 v89.61,46.02 | v46.63,38.51 46.02,39.12 46.02,44.81 46.33,45.11 46.33,45.92 47.65,47.24 v47.65,47.85
PIN31  (via drill 0.41)
  Top 0.203: v45.21,38.2 45.14,38.12 45.14,37.11 U1.26 | v45.82,47.14 47.95,47.14 49.58,45.52 58.93,45.52 59.74,46.33 63.7,46.33 65.33,44.7 67.46,44.7 67.67,44.5 73.76,44.5 74.37,45.11 78.03,45.11 78.44,45.52 80.47,45.52 80.97,46.02 87.99,46.02 v88.7,45.31 | v89,38.61 92.56,38.61 93.37,39.42 95.2,39.42 XIO.12
  Bottom 0.203: v45.82,47.14 45.82,46.74 45.52,46.43 45.52,45.52 45.21,45.21 v45.21,38.2 | v89,38.61 89,42.57 88.7,42.88 v88.7,45.31
PIN32  (via drill 0.41)
  Top 0.203: U1.32 42.15,35.48 v42.47,35.15 | v87.58,36.17 88.19,35.56 XIO.13 94.08,35.56 | v44.4,47.14 45.11,46.43 46.23,46.43 46.53,46.74 47.75,46.74 49.38,45.11 59.13,45.11 59.94,45.92 63.5,45.92 65.13,44.3 67.26,44.3 67.46,44.09 73.97,44.09 74.57,44.7 78.23,44.7 78.64,45.11 80.67,45.11 81.18,45.62 87.27,45.62 v87.58,45.31
  Bottom 0.203: v42.47,35.15 42.47,37.39 41.25,38.61 41.25,47.75 42.16,48.67 42.16,48.97 42.67,49.48 43.79,49.48 44.4,48.77 v44.4,47.14 | v87.58,45.31 v87.58,36.17
PIN33  (via drill 0.41)
  Top 0.203: v56.69,28.35 56.39,28.04 54.97,28.04 54.76,28.25 49.48,28.25 49.28,28.45 43.59,28.45 42.88,27.74 40.34,27.74 39.73,27.13 39.73,26.42 39.12,25.81 38.2,25.81 U1.55 | v88.29,42.27 87.99,42.57 86.16,42.57 85.55,43.18 82.4,43.18 81.89,42.67 79.86,42.67 79.45,42.27 75.79,42.27 75.18,41.66 66.24,41.66 66.04,41.86 63.91,41.86 62.28,43.48 61.16,43.48 60.35,42.67 57.71,42.67 v57.4,42.37 | v88.29,37.8 89.31,36.78 95.3,36.78 XIO.14
  Bottom 0.203: v88.29,37.8 v88.29,42.27 | v56.69,28.35 57.1,28.75 58.62,28.75 60.05,30.18 60.05,34.04 57.51,36.58 57.51,39.83 58.12,40.44 58.12,41.66 v57.4,42.37
PIN34  (via drill 0.41)
  Top 0.203: v56.79,23.98 56.59,23.98 55.88,23.27 52.93,23.27 52.02,22.35 42.06,22.35 40.79,23.62 39.37,23.62 39.22,23.77 38.2,23.77 U1.59 | v68.89,29.36 69.6,29.36 69.8,29.57 73,29.57 73.41,29.16 73.41,28.55 72.75,27.89 72.75,21.54 73.56,20.73 86.11,20.73 89.36,23.98 89.36,29.31 92.96,32.97 XIO.15
  Bottom 0.203: v68.89,29.36 66.34,31.9 62.99,31.9 62.18,31.09 62.18,29.87 58.73,26.42 57.51,26.42 56.79,25.7 v56.79,23.98
PIN35  (via drill 0.41)
  Top 0.203: U1.60 39.1,23.29 39.22,23.16 40.64,23.16 41.86,21.95 52.22,21.95 53.14,22.86 56.08,22.86 56.49,23.27 57.4,23.27 58.01,23.88 v58.12,23.88 | XIO.16 95.2,31.7 93.12,31.7 92.15,30.73 92.15,29.36 90.32,27.53 90.32,23.67 86.51,19.86 73.15,19.86 71.73,21.29 71.73,24.99 71.32,25.4 v67.87,25.4